# Altium schematic sheet MCU_Schematic.SchDoc
size 299 x 250 mm; SheetNumber: 1; SheetTotal: 1
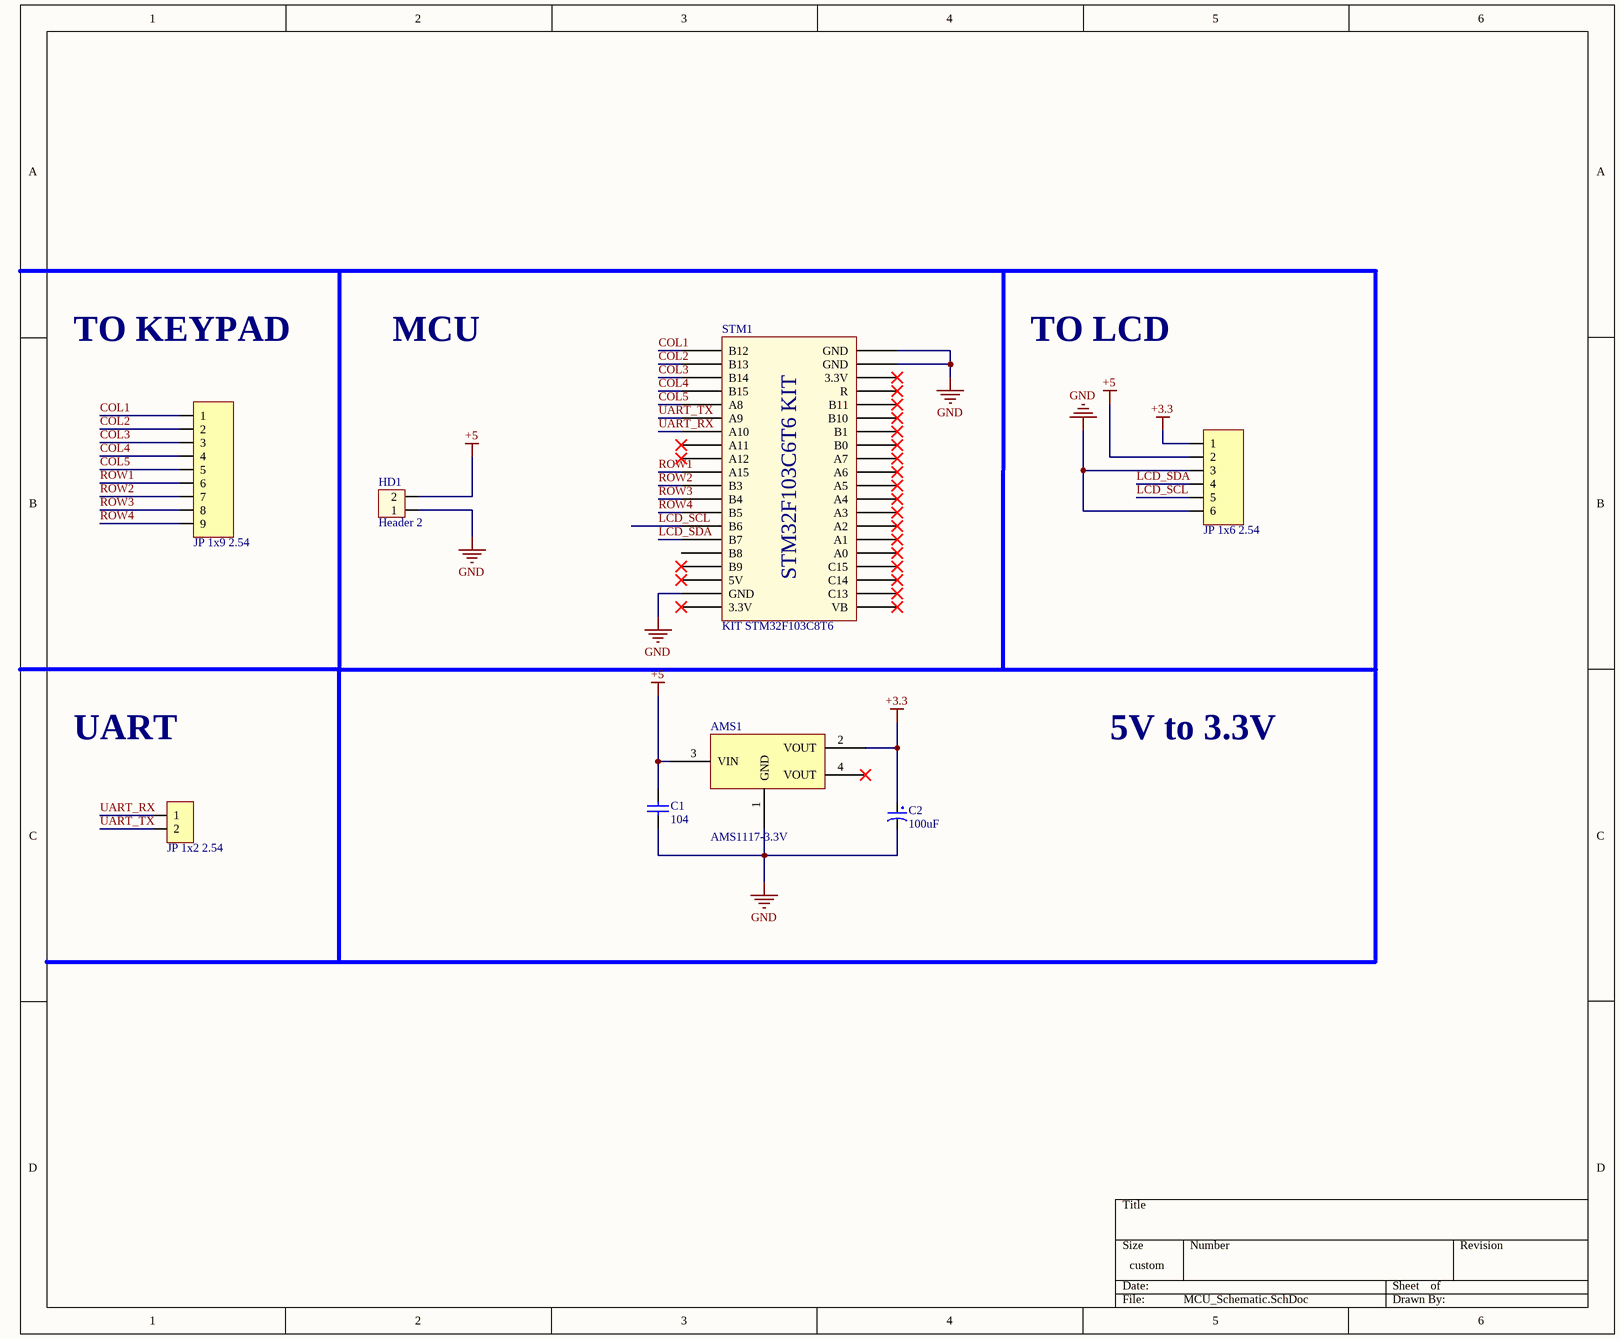
[diagram p0: MCU_Schematic.SchDoc]

## Parts
AMS1  AMS1117-3.3V  [SOT223]
C1  104  [tu gom]
C2  100uF  [tu hoa 5mm]
HD1  Header 2  [HED2]
JP2  JP 1x9 2.54  [JP 1x9 DC]
JP3  JP 1x6 2.54  [JP 1x6 DC]
JP4  JP 1x2 2.54  [JP 1x2 DC]
STM1  KIT STM32F103C8T6  [STM32F103 KIT]

## Nets
+3.3: AMS1.2(VOUT) C2.1 JP3.1
+5: AMS1.3(VIN) C1.1 HD1.2 JP3.2
GND: AMS1.1(GND) C1.2 C2.2 HD1.1 JP3.3 JP3.6 STM1.19(GND) STM1.39(GND) STM1.40(GND)
COL1: JP2.1 STM1.1(B12)
COL2: JP2.2 STM1.2(B13)
COL3: JP2.3 STM1.3(B14)
COL4: JP2.4 STM1.4(B15)
COL5: JP2.5 STM1.5(A8)
LCD_SCL: JP3.5 STM1.14(B6)
LCD_SDA: JP3.4 STM1.15(B7)
ROW1: JP2.6 STM1.10(A15)
ROW2: JP2.7 STM1.11(B3)
ROW3: JP2.8 STM1.12(B4)
ROW4: JP2.9 STM1.13(B5)
UART_RX: JP4.1 STM1.7(A10)
UART_TX: JP4.2 STM1.6(A9)

Not connected (* = marked no-connect by the designer): AMS1 4(VOUT)*; STM1 8(A11)* 9(A12)* 16(B8) 17(B9)* 18(5V)* 20(3.3V)* 21(VB)* 22(C13)* 23(C14)* 24(C15)* 25(A0)* 26(A1)* 27(A2)* 28(A3)* 29(A4)* 30(A5)* 31(A6)* 32(A7)* 33(B0)* 34(B1)* 35(B10)* 36(B11)* 37(R)* 38(3.3V)*

## Notes on the sheet
- TO KEYPAD
- MCU
- TO LCD
- UART
- 5V to 3.3V
- (in symbol STM32f103 Bluepill) STM32F103C6T6 KIT

## Library data of the parts
AMS1 = AMS1117 SMD: Dán; Value: AMS1117-3.3V SOT223; Don_Vi: Con; Ma_Hang: MH000596; Ghi_Chu: *; Kieu_Chan: *; Chung_Loai: Dán
C1 = Tu gom 104 50V: Cắm; So_Chan: 2; Ten_Linh_Kien: Tụ gốm 104 100nF 50V; Don_Vi: Con; Ma_Hang: MH004761; Chung_Loai: Cắm; Kieu_Chan: *
C2 = Tu Hoa 100uF 16V 5x7: Cắm; Don_Vi: Con; So_Chan: 2; Ten_Linh_Kien: Tụ Hóa 100uF 16V 5x7MM; Ma_Hang: MH001347; Chung_Loai: Cắm; Kieu_Chan: *
HD1 = Hed2: Header 2 (Green); Value: Header 2
JP2 = JP 1x9 2.54 Duc Cong: Cắm; Ten_Linh_Kien: Jump Đơn Đực 2.54MM 1x40P Cong Đứng; Don_Vi: Con; Ma_Hang: MH000904; Ghi_Chu: *; Kieu_Chan: *; Chung_Loai: Cắm
JP3 = JP 1x6 2.54 Duc Cong: Cắm; Ten_Linh_Kien: Jump Đơn Đực 2.54MM 1x40P Cong Đứng; Don_Vi: Con; Ma_Hang: MH000904; Ghi_Chu: *; Kieu_Chan: *; Chung_Loai: Cắm
JP4 = JP 1x2 2.54 Duc Cong: Cắm; Ten_Linh_Kien: Jump Đơn Đực 2.54MM 1x40P Cong Đứng; Don_Vi: Con; Ma_Hang: MH000904; Ghi_Chu: *; Kieu_Chan: *; Chung_Loai: Cắm
STM1 = STM32f103 Bluepill: KIT STM32F103C8T6 Bluepill